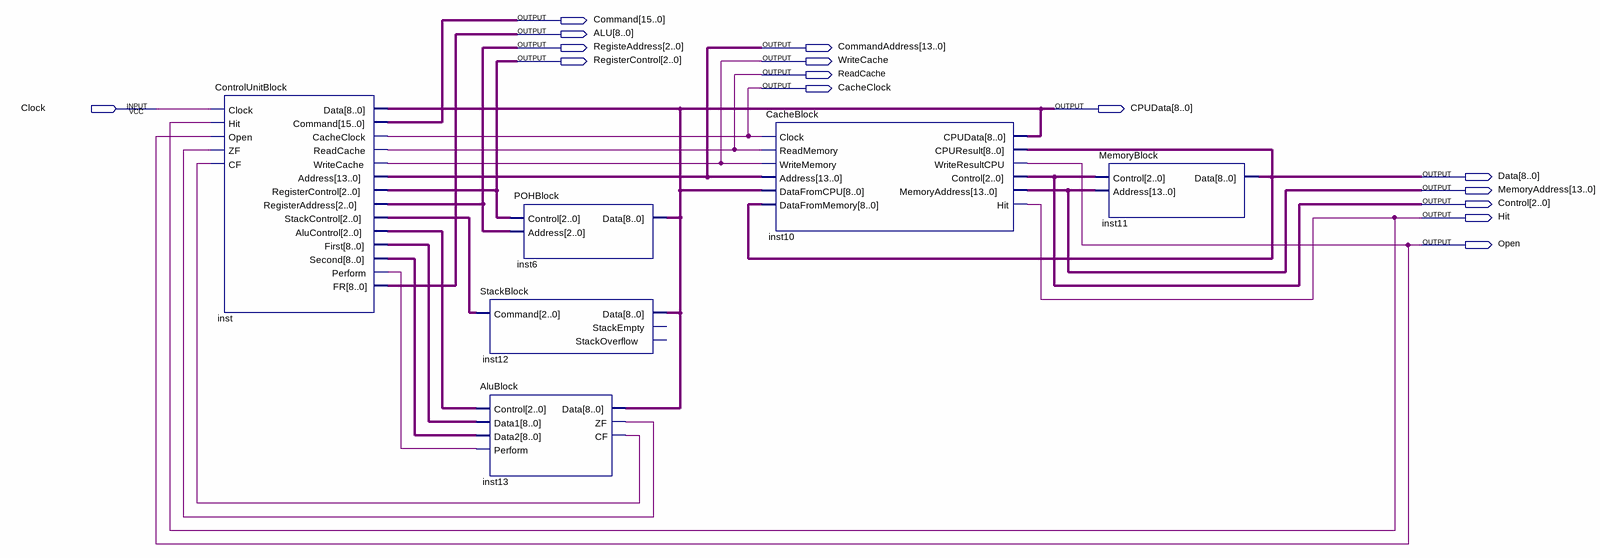
[diagram p0: schematic sheet]
// Quartus schematic TestingBlock.bdf as structural Verilog: 6 symbols, 15 pins
module TestingBlock (
  input  Clock,
  output [15:0] Command,
  output [8:0] ALU,
  output [2:0] RegisteAddress,
  output [13:0] CommandAddress,
  output [2:0] RegisterControl,
  output WriteCache,
  output ReadCache,
  output CacheClock,
  output [8:0] CPUData,
  output [8:0] Data,
  output [13:0] MemoryAddress,
  output [2:0] Control,
  output Hit,
  output Open
);

  wire inst13_cf, inst13_zf, inst_perform;
  wire [2:0] inst_alucontrol, inst_stackcontrol;
  wire [8:0] inst_first, inst_second;

  ControlUnitBlock inst (
    .Clock(Clock), .Hit(Hit), .Open(Open), .ZF(inst13_zf), .CF(inst13_cf), .Command(Command),
    .CacheClock(CacheClock), .ReadCache(ReadCache), .WriteCache(WriteCache), .Address(CommandAddress),
    .RegisterControl(RegisterControl), .RegisterAddress(RegisteAddress), .StackControl(inst_stackcontrol),
    .AluControl(inst_alucontrol), .First(inst_first), .Second(inst_second), .Perform(inst_perform), .FR(ALU),
    .Data(CPUData));
  StackBlock inst12 (.Command(inst_stackcontrol), .Data(CPUData));  // open: StackEmpty, StackOverflow
  AluBlock inst13 (
    .Control(inst_alucontrol), .Data1(inst_first), .Data2(inst_second), .Perform(inst_perform),
    .Data(CPUData), .ZF(inst13_zf), .CF(inst13_cf));
  POHBlock inst6 (.Control(RegisterControl), .Address(RegisteAddress), .Data(CPUData));
  CacheBlock inst10 (
    .Clock(CacheClock), .ReadMemory(ReadCache), .WriteMemory(WriteCache), .Address(CommandAddress),
    .DataFromCPU(CPUData), .DataFromMemory(Data), .CPUData(CPUData), .CPUResult(Data), .WriteResultCPU(Open),
    .Control(Control), .MemoryAddress(MemoryAddress), .Hit(Hit));
  MemoryBlock inst11 (.Control(Control), .Address(MemoryAddress), .Data(Data));
endmodule
